# Altium schematic sheet ProbadorDeCables_Accesorios_A_SZCNT_2.SchDoc
size A4
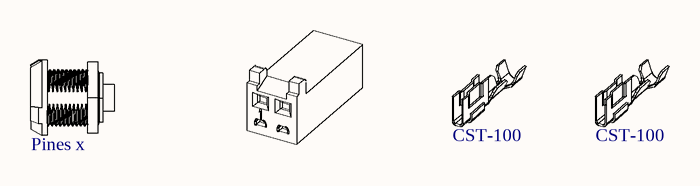
[diagram p0: ProbadorDeCables_Accesorios_A_SZCNT_2.SchDoc]

## Parts
BOM_A35  Pines: Pines x  [BOM_SZCNT_Hembra]  (hidden comment: SZCNT_0x_Hembra)  (mechanical)
BOM_A35__1  CST-100-2  [BOM_CST-100-2]  (value not drawn)  (mechanical)
BOM_A35__2  ParaHousing: CST-100  [BOM_sock_CST_1375819-1]  (hidden comment: sock_CST_1375819-1)  (mechanical)
BOM_A35__3  ParaHousing: CST-100  [BOM_sock_CST_1375819-1]  (hidden comment: sock_CST_1375819-1)  (mechanical)

## Library data of the parts
BOM_A35 = SZCNT_0x_Hembra: Conector SZCNT x vías hembra para gabinete; Cod.DigiKey: Se compra a SZCNT; Cod.Fabricante: *; ComponentLink1Description: Manufacturer Link; ComponentLink1URL: *; DIGIKEYx100: *; Fabricante: SZCNT; DIGIKEYx50: *
BOM_A35__1 = CST-100-2: CONN RCPT HSNG 2POS CST-100 II; Cod.Fabricante: 1375820-2; Fabricante: TE Connectivity AMP Connectors; Cod.DigiKey: A99613-ND; ComponentLink1Description: Manufacturer Link; ComponentLink1URL: https://www.te.com/commerce/DocumentDelivery/DDEController?Action=srchrtrv&DocNm=1375820&DocType=Customer+Drawing&DocLang=English; DIGIKEYx50: 0.08380; DIGIKEYx100: NO
BOM_A35__2 BOM_A35__3 = sock_CST_1375819-1: CONN SOCKET 22-26AWG CRIMP TIN; Fabricante: TE Connectivity AMP Connectors; Cod.DigiKey: A100453CT-ND; Cod.Fabricante: 1375819-1; ComponentLink1Description: Manufacturer Link; ComponentLink1URL: https://www.te.com/commerce/DocumentDelivery/DDEController?Action=srchrtrv&DocNm=1375819&DocType=Customer+Drawing&DocLang=English; DIGIKEYx100: 0.04210; DIGIKEYx50: 0.03960